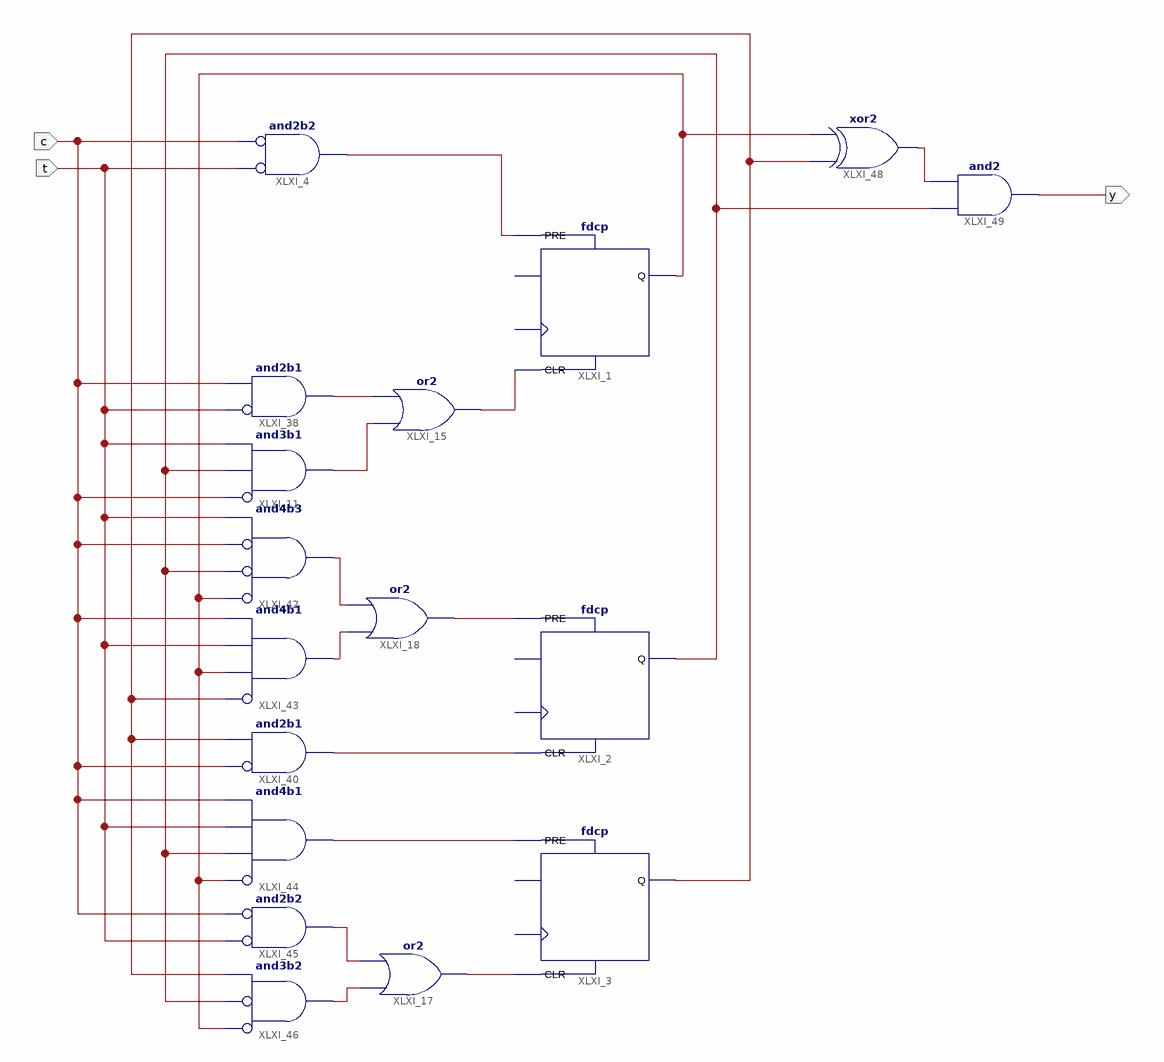
[diagram p0: schematic sheet 1]
// Xilinx ISE schematic detector.sch (spartan3adsp) as structural Verilog: 17 symbols, 3 ports
module detector (
  input  c,
  input  t,
  output y
);

  wire XLXN_17, XLXN_19, XLXN_21, XLXN_23, XLXN_41, XLXN_42, XLXN_43, XLXN_57, XLXN_58, XLXN_59, XLXN_63,
       XLXN_68, XLXN_88, XLXN_89, XLXN_90, XLXN_94;

  and XLXI_11 (XLXN_43, ~c, XLXN_21, t);  // and3b1
  or XLXI_15 (XLXN_41, XLXN_43, XLXN_42);
  or XLXI_17 (XLXN_90, XLXN_89, XLXN_88);
  or XLXI_18 (XLXN_59, XLXN_58, XLXN_57);
  fdcp XLXI_3 (.CLR(XLXN_90), .PRE(XLXN_68), .Q(XLXN_23));  // open: C, D
  fdcp XLXI_2 (.CLR(XLXN_63), .PRE(XLXN_59), .Q(XLXN_21));  // open: C, D
  and XLXI_4 (XLXN_17, ~t, ~c);  // and2b2
  fdcp XLXI_1 (.CLR(XLXN_41), .PRE(XLXN_17), .Q(XLXN_19));  // open: C, D
  and XLXI_40 (XLXN_63, ~c, XLXN_23);  // and2b1
  and XLXI_42 (XLXN_57, ~XLXN_19, ~XLXN_21, ~c, t);  // and4b3
  and XLXI_43 (XLXN_58, ~XLXN_23, XLXN_19, t, c);  // and4b1
  and XLXI_44 (XLXN_68, ~XLXN_19, XLXN_21, t, c);  // and4b1
  and XLXI_46 (XLXN_89, ~XLXN_19, ~XLXN_21, XLXN_23);  // and3b2
  and XLXI_45 (XLXN_88, ~t, ~c);  // and2b2
  and XLXI_38 (XLXN_42, ~t, c);  // and2b1
  xor XLXI_48 (XLXN_94, XLXN_23, XLXN_19);
  and XLXI_49 (y, XLXN_21, XLXN_94);
endmodule
